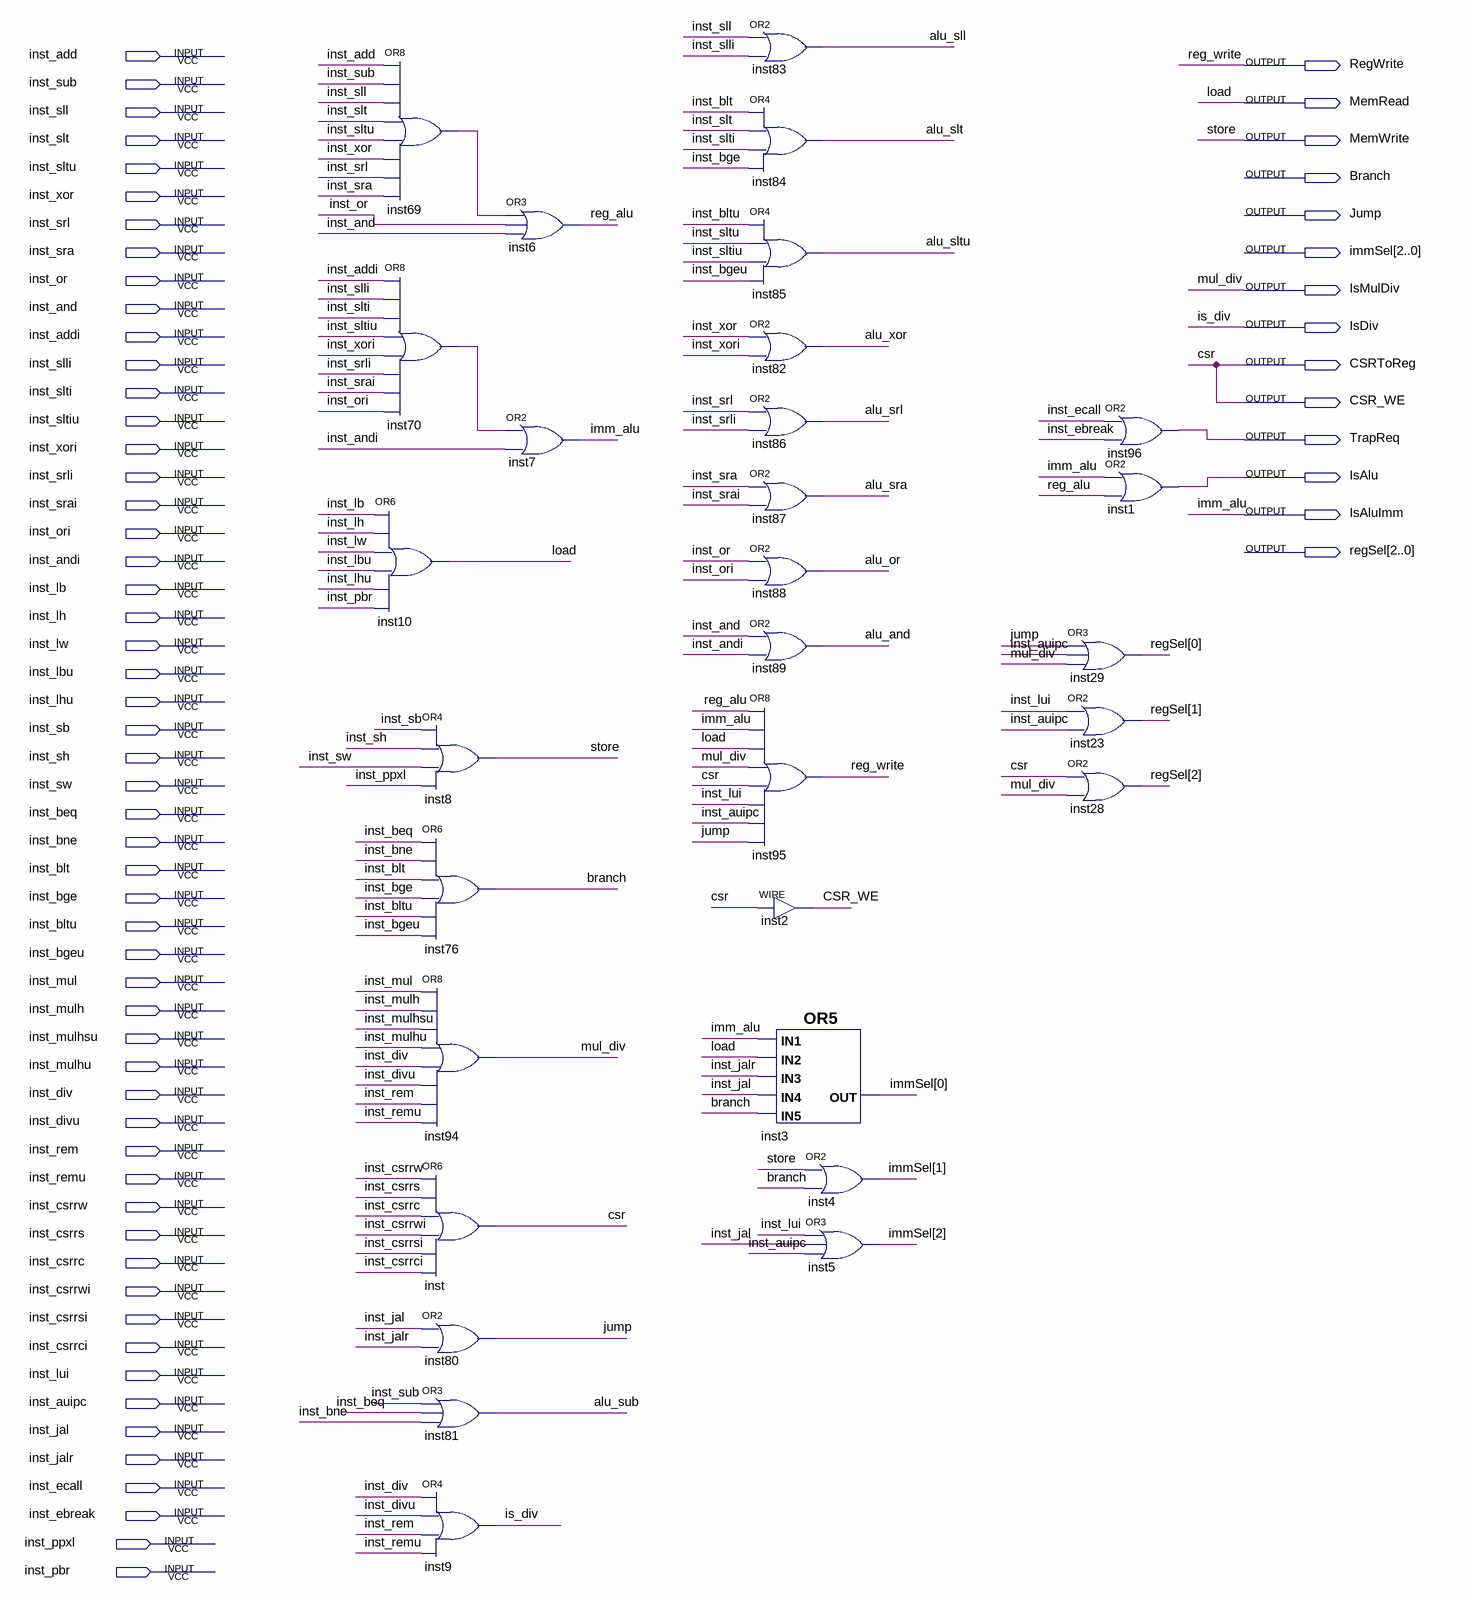
[diagram p0: schematic sheet]
// Quartus schematic ControlSignals.bdf as structural Verilog: 30 symbols, 69 pins
module ControlSignals (
  input  inst_add,
  input  inst_sub,
  input  inst_sll,
  input  inst_slt,
  input  inst_sltu,
  input  inst_xor,
  input  inst_srl,
  input  inst_sra,
  input  inst_or,
  input  inst_and,
  input  inst_addi,
  input  inst_slli,
  input  inst_slti,
  input  inst_sltiu,
  input  inst_xori,
  input  inst_srli,
  input  inst_srai,
  input  inst_ori,
  input  inst_andi,
  input  inst_lb,
  input  inst_lh,
  input  inst_lw,
  input  inst_lbu,
  input  inst_lhu,
  input  inst_sb,
  input  inst_sh,
  input  inst_sw,
  input  inst_beq,
  input  inst_bne,
  input  inst_blt,
  input  inst_bge,
  input  inst_bltu,
  input  inst_bgeu,
  input  inst_mul,
  input  inst_mulh,
  input  inst_mulhsu,
  input  inst_mulhu,
  input  inst_div,
  input  inst_divu,
  input  inst_rem,
  input  inst_remu,
  input  inst_csrrw,
  input  inst_csrrs,
  input  inst_csrrc,
  input  inst_csrrwi,
  input  inst_csrrsi,
  input  inst_csrrci,
  input  inst_lui,
  input  inst_auipc,
  input  inst_jal,
  input  inst_jalr,
  input  inst_ecall,
  input  inst_ebreak,
  input  inst_ppxl,
  input  inst_pbr,
  output RegWrite,
  output MemRead,
  output MemWrite,
  output Branch,
  output Jump,
  output [2:0] immSel,
  output IsMulDiv,
  output IsDiv,
  output CSRToReg,
  output CSR_WE,
  output TrapReq,
  output IsAlu,
  output IsAluImm,
  output [2:0] regSel
);

  wire alu_and, alu_or, alu_sll, alu_slt, alu_sltu, alu_sra, alu_srl, alu_sub, alu_xor, inst69_out,
       inst70_out, reg_alu;

  or inst69 (inst69_out, inst_add, inst_sub, inst_sll, inst_slt, inst_sltu, inst_xor, inst_srl, inst_sra);
  or inst70 (inst70_out, inst_addi, inst_slli, inst_slti, inst_sltiu, inst_xori, inst_srli, inst_srai, inst_ori);
  or inst10 (MemRead, inst_lb, inst_lh, inst_lw, inst_lbu, inst_lhu, inst_pbr);
  or inst8 (MemWrite, inst_sb, inst_sh, inst_sw, inst_ppxl);
  or inst76 (Branch, inst_beq, inst_bne, inst_blt, inst_bge, inst_bltu, inst_bgeu);
  or inst94 (IsMulDiv, inst_mul, inst_mulh, inst_mulhsu, inst_mulhu, inst_div, inst_divu, inst_rem, inst_remu);
  or inst (CSR_WE, inst_csrrw, inst_csrrs, inst_csrrc, inst_csrrwi, inst_csrrsi, inst_csrrci);
  or inst80 (Jump, inst_jal, inst_jalr);
  or inst81 (alu_sub, inst_sub, inst_beq, inst_bne);
  or inst9 (IsDiv, inst_div, inst_divu, inst_rem, inst_remu);
  or inst6 (reg_alu, inst69_out, inst_or, inst_and);
  or inst7 (IsAluImm, inst70_out, inst_andi);
  or inst83 (alu_sll, inst_sll, inst_slli);
  or inst84 (alu_slt, inst_blt, inst_slt, inst_slti, inst_bge);
  or inst85 (alu_sltu, inst_bltu, inst_sltu, inst_sltiu, inst_bgeu);
  or inst82 (alu_xor, inst_xor, inst_xori);
  or inst86 (alu_srl, inst_srl, inst_srli);
  or inst87 (alu_sra, inst_sra, inst_srai);
  or inst88 (alu_or, inst_or, inst_ori);
  or inst89 (alu_and, inst_and, inst_andi);
  or inst95 (RegWrite, reg_alu, IsAluImm, MemRead, IsMulDiv, CSR_WE, inst_lui, inst_auipc, Jump);
  assign CSR_WE = CSR_WE;  // WIRE inst2
  or inst3 (immSel[0], IsAluImm, MemRead, inst_jalr, inst_jal, Branch);
  or inst4 (immSel[1], MemWrite, Branch);
  or inst5 (immSel[2], inst_lui, inst_jal, inst_auipc);
  or inst29 (regSel[0], Jump, inst_auipc, IsMulDiv);
  or inst23 (regSel[1], inst_lui, inst_auipc);
  or inst28 (regSel[2], CSR_WE, IsMulDiv);
  or inst96 (TrapReq, inst_ecall, inst_ebreak);
  or inst1 (IsAlu, IsAluImm, reg_alu);

  assign CSRToReg = CSR_WE;

  // Other names for the same wires on the sheet: csr = CSR_WE; imm_alu = IsAluImm; is_div = IsDiv; load = MemRead;
  //   mul_div = IsMulDiv; reg_write = RegWrite; store = MemWrite
endmodule
